# Altium schematic sheet MCU.SchDoc
size A4; Author: Gabriel; Organization: Altium Limited; Address1: L3, 12a Rodborough Rd; Address2: Frenchs Forest; Address3: NSW; Address4: Australia 2086; SheetNumber: 1; SheetTotal: 1
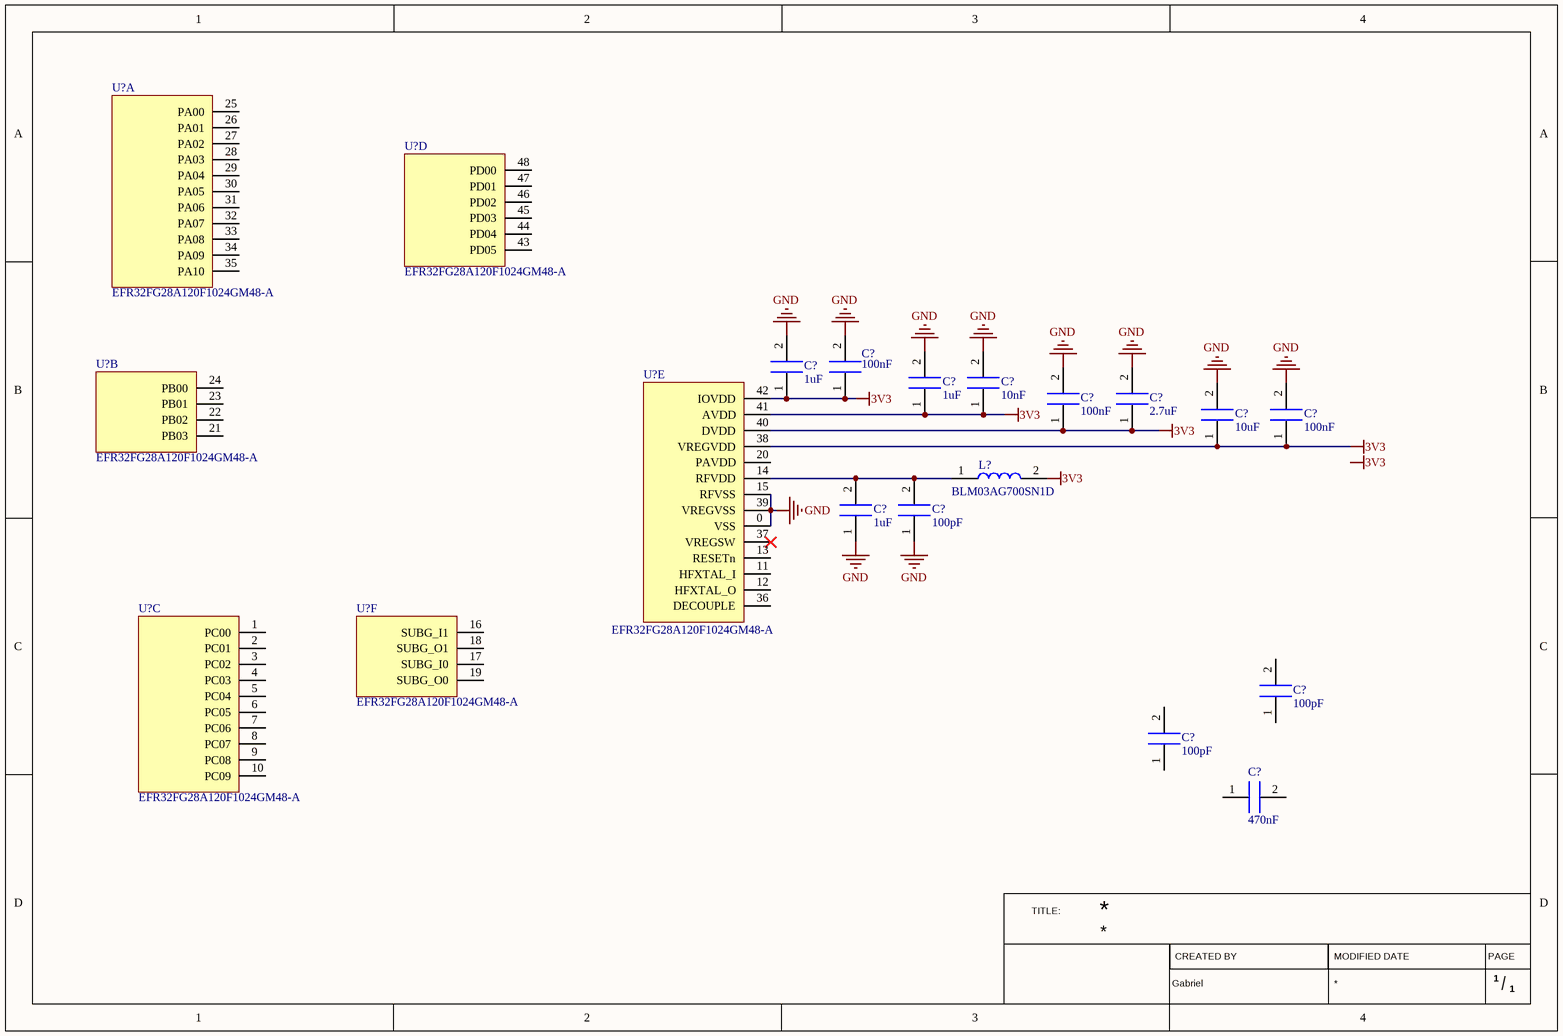
[diagram p0: MCU.SchDoc]

## Parts
(Parts that share a designator on the sheet are numbered #1, #2 ... from top to bottom, then left to right.)
C?#1  value 1uF  [CAP_0402]  (hidden comment: 1uF_10%_35V_0402_GRM155R6YA105KE11J)
C?#2  value 100nF  [CAP_0402]  (hidden comment: 100nF_10%_16V_0402_GRM155R71C104KA88J)
C?#3  value 1uF  [CAP_0402]  (hidden comment: 1uF_10%_35V_0402_GRM155R6YA105KE11J)
C?#4  value 10nF  [CAP_0402]  (hidden comment: 10nF_10%_6.3V_0402_CC0402KRX7R5BB103)
C?#5  value 100nF  [CAP_0402]  (hidden comment: 100nF_10%_16V_0402_GRM155R71C104KA88J)
C?#6  value 2.7uF  [CAP_0805]  (hidden comment: 2.7uF_10%_10V_0805_X5R_C0805C275K8PAC7800)
C?#7  value 10uF  [CAP_0402]  (hidden comment: 10uF_20%_6.3V_0402_GRM155R60J106ME05D)
C?#8  value 100nF  [CAP_0402]  (hidden comment: 100nF_10%_16V_0402_GRM155R71C104KA88J)
C?#9  value 1uF  [CAP_0402]  (hidden comment: 1uF_10%_35V_0402_GRM155R6YA105KE11J)
C?#10  value 100pF  [CAP_0402]  (hidden comment: 100pF_5%_50V_0402_CC0402JRNPO9BN101)
C?#11  value 100pF  [CAP_0402]  (hidden comment: 100pF_5%_50V_0402_CC0402JRNPO9BN101)
C?#12  value 100pF  [CAP_0402]  (hidden comment: 100pF_5%_50V_0402_CC0402JRNPO9BN101)
C?#13  value 470nF  [CAP_0402]  (hidden comment: 470nF_10%_6.3V_0402_GCM1555C1H101JA16D)
L?  MANUFACTURER REFERENCE: BLM03AG700SN1D  [IND_0201]  (hidden comment: 10uH_50%_200mA_BLM03AG700SN1D)
U?#1  MANUFACTURER REFERENCE: EFR32FG28A120F1024GM48-A  [QFN48 0606]  (hidden comment: MCU_1MB_256kB_EFR32FG28A120F1024GM48-A)  (part A of 6)
U?#2  MANUFACTURER REFERENCE: EFR32FG28A120F1024GM48-A  [QFN48 0606]  (hidden comment: MCU_1MB_256kB_EFR32FG28A120F1024GM48-A)  (part D of 6)
U?#3  MANUFACTURER REFERENCE: EFR32FG28A120F1024GM48-A  [QFN48 0606]  (hidden comment: MCU_1MB_256kB_EFR32FG28A120F1024GM48-A)  (part B of 6)
U?#4  MANUFACTURER REFERENCE: EFR32FG28A120F1024GM48-A  [QFN48 0606]  (hidden comment: MCU_1MB_256kB_EFR32FG28A120F1024GM48-A)  (part E of 6)
U?#5  MANUFACTURER REFERENCE: EFR32FG28A120F1024GM48-A  [QFN48 0606]  (hidden comment: MCU_1MB_256kB_EFR32FG28A120F1024GM48-A)  (part C of 6)
U?#6  MANUFACTURER REFERENCE: EFR32FG28A120F1024GM48-A  [QFN48 0606]  (hidden comment: MCU_1MB_256kB_EFR32FG28A120F1024GM48-A)  (part F of 6)

## Nets
3V3: C?#1.1 C?#2.1 C?#3.1 C?#4.1 C?#5.1 C?#6.1 C?#7.1 C?#8.1 L?.2 U?#4.38(VREGVDD) U?#4.40(DVDD) U?#4.41(AVDD) U?#4.42(IOVDD)
GND: C?#1.2 C?#2.2 C?#3.2 C?#4.2 C?#5.2 C?#6.2 C?#7.2 C?#8.2 C?#9.1 C?#10.1 U?#4.0(VSS) U?#4.15(RFVSS) U?#4.39(VREGVSS)
NetC?#9_2: C?#9.2 C?#10.2 L?.1 U?#4.14(RFVDD)

Not connected (* = marked no-connect by the designer): C?#11 1 2; C?#12 1 2; C?#13 1 2; U?#1 25(PA00) 26(PA01) 27(PA02) 28(PA03) 29(PA04) 30(PA05) 31(PA06) 32(PA07) 33(PA08) 34(PA09) 35(PA10); U?#2 43(PD05) 44(PD04) 45(PD03) 46(PD02) 47(PD01) 48(PD00); U?#3 21(PB03) 22(PB02) 23(PB01) 24(PB00); U?#4 11(HFXTAL_I) 12(HFXTAL_O) 13(RESETn) 20(PAVDD) 36(DECOUPLE) 37(VREGSW)*; U?#5 1(PC00) 2(PC01) 3(PC02) 4(PC03) 5(PC04) 6(PC05) 7(PC06) 8(PC07) 9(PC08) 10(PC09); U?#6 16(SUBG_I1) 17(SUBG_I0) 18(SUBG_O1) 19(SUBG_O0)

## Notes on the sheet
- Labels drawn without touching a wire or pin: 3V3
- TITLE:
- CREATED BY
- MODIFIED DATE
- PAGE
- /

## Library data of the parts
C?#1 C?#3 C?#9 = 1uF_10%_35V_0402_GRM155R6YA105KE11J: CAPACITOR 1uF 10% X5R 0402; MANUFACTURER: MURATA; VOLTAGE RATING: 35V; DIELECTRIC: X5R; TOLERANCE: 10%; PACKAGING: 0402; MOUNTING: SMD; MANUFACTURER REFERENCE: GRM155R6YA105KE11J
C?#2 C?#5 C?#8 = 100nF_10%_16V_0402_GRM155R71C104KA88J: CAPACITOR 100nF 10% X7R 0402; MANUFACTURER: MURATA; DIELECTRIC: X5R; VOLTAGE RATING: 16V; TOLERANCE: 10%; PACKAGING: 0402; MOUNTING: SMD; MANUFACTURER REFERENCE: GRM155R71C104KA88J
C?#4 = 10nF_10%_6.3V_0402_CC0402KRX7R5BB103: CAPACITOR 10nF 10% 6.3V 0402 CC0402KRX7R5BB103; MANUFACTURER: YAGEO; DIELECTRIC: X7R; TOLERANCE: 10%; VOLTAGE RATING: 6.3V; PACKAGING: 0402; MOUNTING: SMD; MANUFACTURER REFERENCE: CC0402KRX7R5BB103
C?#6 = 2.7uF_10%_10V_0805_X5R_C0805C275K8PAC7800: CAP 2.7uF 10% 10V 0805 X5R C0805C275K8PAC7800; MANUFACTURER: KEMET; DIELECTRIC: X5R; TOLERANCE: 10%; VOLTAGE RATING: 10V; PACKAGING: 0805; MOUNTING: SMD; MANUFACTURER REFERENCE: C0805C275K8PAC7800
C?#7 = 10uF 20% 6.3V 0402 GRM155R60J106ME05D: CAPACITOR 10uF 20% 6.3V 0402 GRM155R60J106ME05D; MANUFACTURER: MURATA; DIELECTRIC: X5R; TOLERANCE: 20%; VOLTAGE RATING: 6.3V; PACKAGING: 0402; MOUNTING: SMD; MANUFACTURER REFERENCE: GRM155R60J106ME05D
C?#10-C?#12 = 100pF_5%_50V_0402_CC0402JRNPO9BN101: CAPACITOR 100pF 5% 50V 0402 CC0402JRNPO9BN101; MANUFACTURER: YAGEO; DIELECTRIC: C0G, NP0; TOLERANCE: 5%; VOLTAGE RATING: 50V; PACKAGING: 0402; MOUNTING: SMD; MANUFACTURER REFERENCE: CC0402JRNPO9BN101
C?#13 = 470nF_10%_6.3V_0402_GCM1555C1H101JA16D: CAPACITOR 470nF 10% 6.3V 0402 GCM1555C1H101JA16D; MANUFACTURER: MURATA; DIELECTRIC: X6S; TOLERANCE: 5%; VOLTAGE RATING: 6.3V; PACKAGING: 0402; MOUNTING: SMD; MANUFACTURER REFERENCE: GCM1555C1H101JA16D
L? = 10uH 50% 200mA BLM03AG700SN1D: INDUCTOR 10uH 50% 200mA BLM03AG700SN1D; MANUFACTURER: MURATA; TOLERANCE: 50%; PACKAGING: 0201; MOUNTING: SMD; CURRENT RATING: 200mA; VALUE: 10uH
U?#1-U?#6 = MCU_1MB_256kB_EFR32FG28A120F1024GM48-A: MCU 1MB 256kB EFR32FG28A120F1024GM48-A; MANUFACTURER: SILICON LABS; PACKAGING: QFN48 0606; FLASH SIZE: 1 MB; RAM SIZE: 256 KB; PIN COUNT: 48